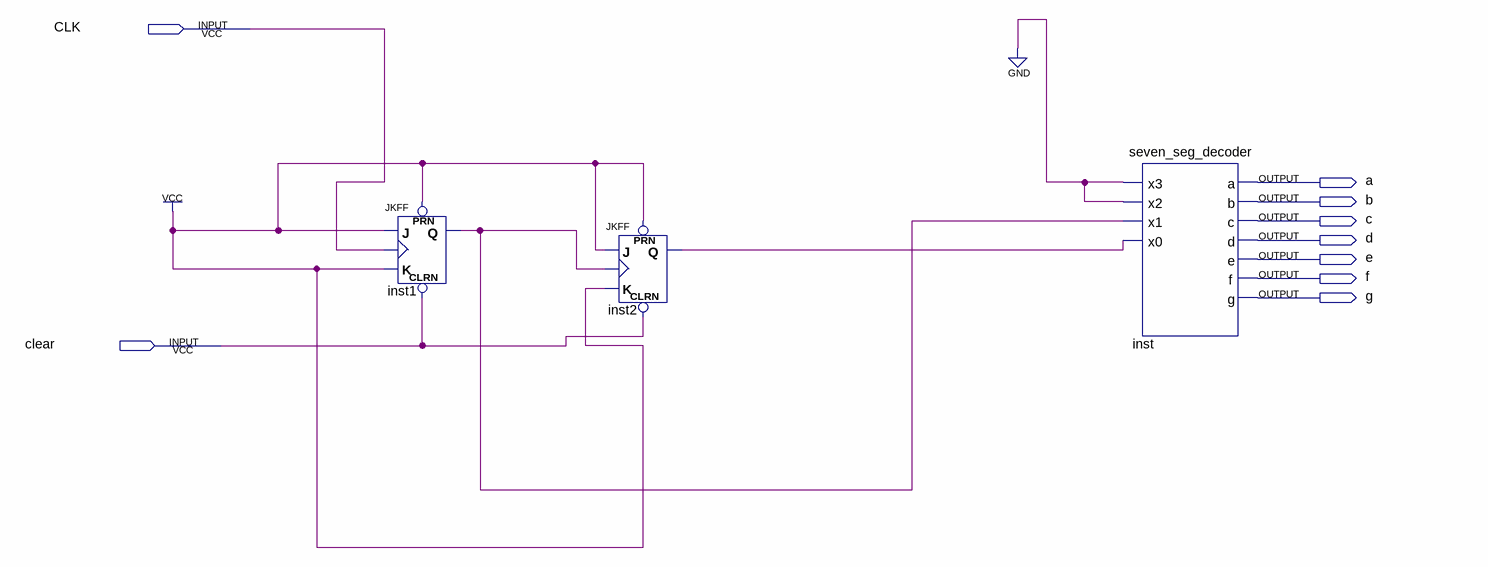
[diagram p0: schematic sheet]
// Quartus schematic upCounter.bdf as structural Verilog: 3 symbols, 9 pins
module upCounter (
  input  CLK,
  input  clear,
  output a,
  output b,
  output c,
  output d,
  output e,
  output f,
  output g
);

  wire inst1_q, inst2_q;

  JKFF inst1 (.PRN(1'b1), .CLRN(clear), .K(1'b1), .J(1'b1), .CLK(CLK), .Q(inst1_q));
  JKFF inst2 (.PRN(1'b1), .CLRN(clear), .K(1'b1), .J(1'b1), .CLK(inst1_q), .Q(inst2_q));
  seven_seg_decoder inst (
    .x3(1'b0), .x2(1'b0), .x1(inst1_q), .x0(inst2_q), .a(a), .b(b), .c(c), .d(d), .e(e), .f(f), .g(g));
endmodule
